# Altium schematic sheet ublox_wifi.SchDoc
size A4; SheetNumber: 8; SheetTotal: 8
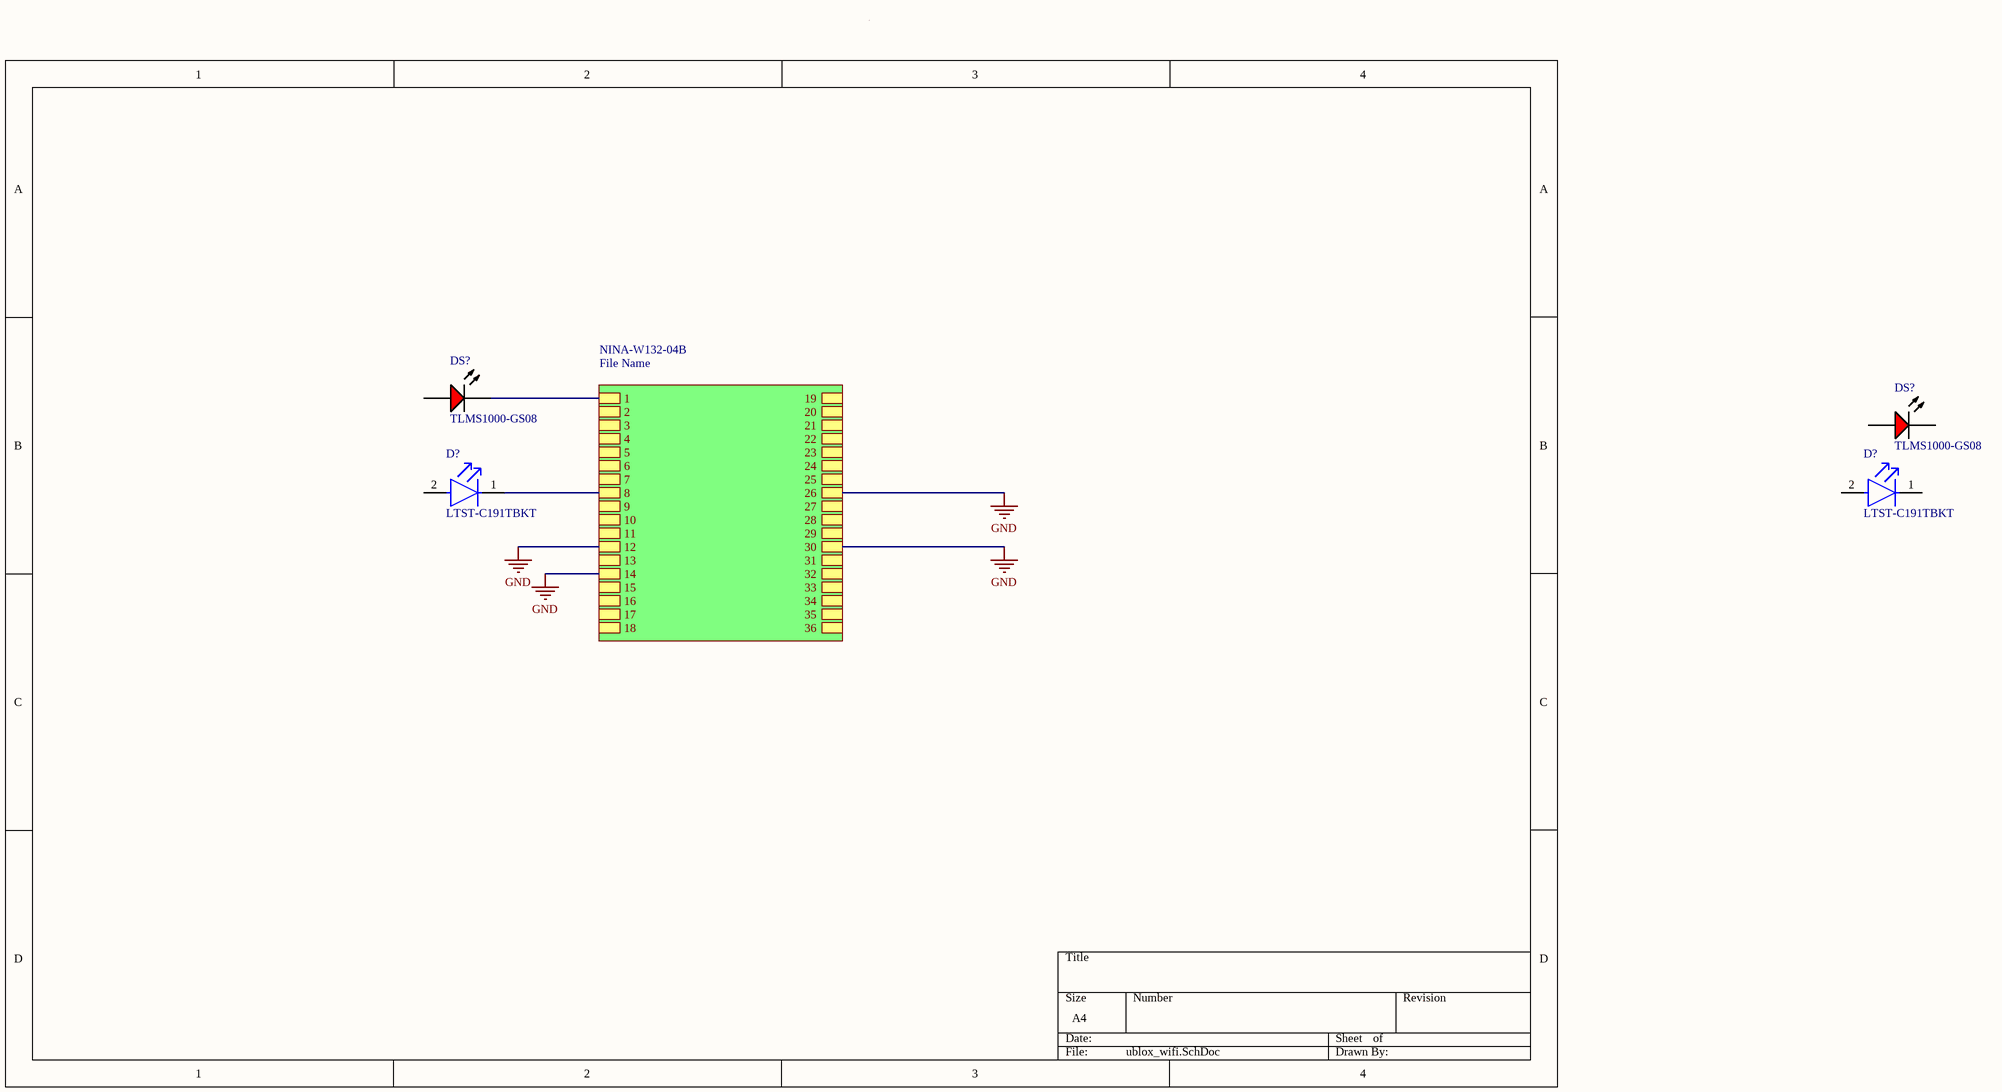
[diagram p0: ublox_wifi.SchDoc]

## Parts
(Parts that share a designator on the sheet are numbered #1, #2 ... from top to bottom, then left to right.)
D?#1  LTST-C191TBKT  [FP-LTST-C191TBKT-MFG]
D?#2  LTST-C191TBKT  [FP-LTST-C191TBKT-MFG]
DS?#1  TLMS1000-GS08  [VISH-TLMS1000_V]
DS?#2  TLMS1000-GS08  [VISH-TLMS1000_V]

## Sub-sheets
NINA-W132-04B = File Name: 1, 2, 3, 4, 5, 6, 7, 8, 9, 10, 11, 12, 13, 14, 16, 15, 17, 18, 19, 20, 21, 22, 23, 24, 25, 26, 27, 28, 29, 30, 31, 32, 33, 34, 35, 36

## Nets
GND: sheet NINA-W132-04B/12, sheet NINA-W132-04B/14, sheet NINA-W132-04B/26, sheet NINA-W132-04B/30
NetD?#1_1: D?#1.1(C) ; sheet NINA-W132-04B/8
NetDS?#1_2: DS?#1.2(K) ; sheet NINA-W132-04B/1

Not connected (* = marked no-connect by the designer): D?#1 2(A); D?#2 1(C) 2(A); DS?#1 1(A); DS?#2 1(A) 2(K)

## Library data of the parts
D?#1 D?#2 = CMP-22017-000008-1: LED BLUE CLEAR CHIP SMD; Lens Color: Colorless; Dominant Wavelength: 475nm; Forward Current: 20mA; Wavelength: 468nm; Viewing Angle: 130°; Power Dissipation: 76mW; Luminous Intensity: 180mcd; Reverse Voltage: 5V; Number of Elements: 1; Lens Style: Diffused; Forward Voltage: 3.8V; Max Power Dissipation: 75mW; Case Code (Metric): 1608; Packaging: Tape and Reel; Case/Package: 0603; Depth: 1.6mm; Mount: Surface Mount; Lead Free: Lead Free; Min Operating Temperature: -20°C; Lens Transparency: Clear; Illumination Color: Blue; Height: 0.55mm; Test Current: 20mA; Case Code (Imperial): 0603; Max Operating Temperature: 80°C; Number of Pins: 2; Length: 0.8mm; Radiation Hardening: No; Package Quantity: 1; Number of LEDs: 1; Width: 0.8mm; Color: Blue
DS?#1 DS?#2 = CMP-2000-07254-1: Low Current LED, 40 mW, 1.8 V, -40 to 100 degC, 2-Pin SMD (0603), RoHS, Tape and Reel; Manufacturer: Vishay; Lens Shape: Rectangular; Automotive Qualification Standard: AEC-Q100; Wavelength Typ: 636nm; SVHC: ToBeAdvised; LED Colour: Red; Bulb Size: 1.6mmx0.8mm; Forward Voltage: 1.8V; Luminous Intensity: 4mcd; Forward Current If: 2mA; Viewing Angle: 80°; Datasheet Version: Rev. 1.7, 02/2011; Datasheet URL: https://datasheet.ciiva.com/5798/1698881-5798337.pdf; LED Mounting: SMD; Packaging: CutTape; Package Reference: TLMS1000; Manufacturer URL: http://www.vishay.com/; Mounting Technology: SurfaceMount; Product Range: -; Package Description: 2-Pin Surface Mount Device, Body 1.6 x 0.8 mm; MSL: MSL2-1year